# EAGLE design Proyecto_etapa_1_y_2 (EAGLE 7.5.0)
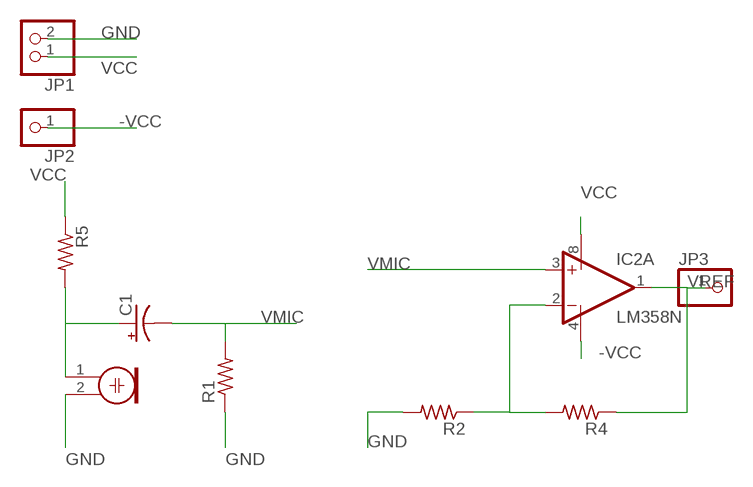
[diagram p0: schematic, sheet 1]

## Parts
C1  CPOL-USE2.5-6  [E2,5-6]
IC2  LM358N  [DIL08]
JP1  PINHD-1X2  [1X02]
JP2  PINHD-1X1  [1X01]
JP3  PINHD-1X1  [1X01]
M2  ELECTRET_MICROPHON-F6050AP  [F6050AP]
R1  R-US_0207/10  [0207/10]
R2  R-US_0207/10  [0207/10]
R4  R-US_0207/10  [0207/10]
R5  R-US_0207/10  [0207/10]

## Nets
-VCC: IC2.4(P:V-) JP2.1
GND: JP1.2 M2.2 R1.1 R2.2
N$1: C1.+ M2.1 R5.2
N$2: IC2.2(A:-IN) R2.1 R4.2
VCC: IC2.8(P:V+) JP1.1 R5.1
VMIC: C1.- IC2.3(A:+IN) R1.2
VREF: IC2.1(A:OUT) JP3.1 R4.1
Unconnected: IC2.5(B:+IN) IC2.6(B:-IN) IC2.7(B:OUT)

## Library data of the parts
C1 = rcl:CPOL-US: POLARIZED CAPACITOR, American symbol
IC2 = linear:LM358: OP AMP also LM158; LM258; LM2904 Source: http://cache.national.com/ds/LM/LM158.pdf
JP1 = pinhead:PINHD-1X2: PIN HEADER
JP2 JP3 = pinhead:PINHD-1X1: PIN HEADER
M2 = microphon:ELECTRET_MICROPHON-: Electret Condenser Microphone
R1 R2 R4 R5 = rcl:R-US_: RESISTOR, American symbol

## Board
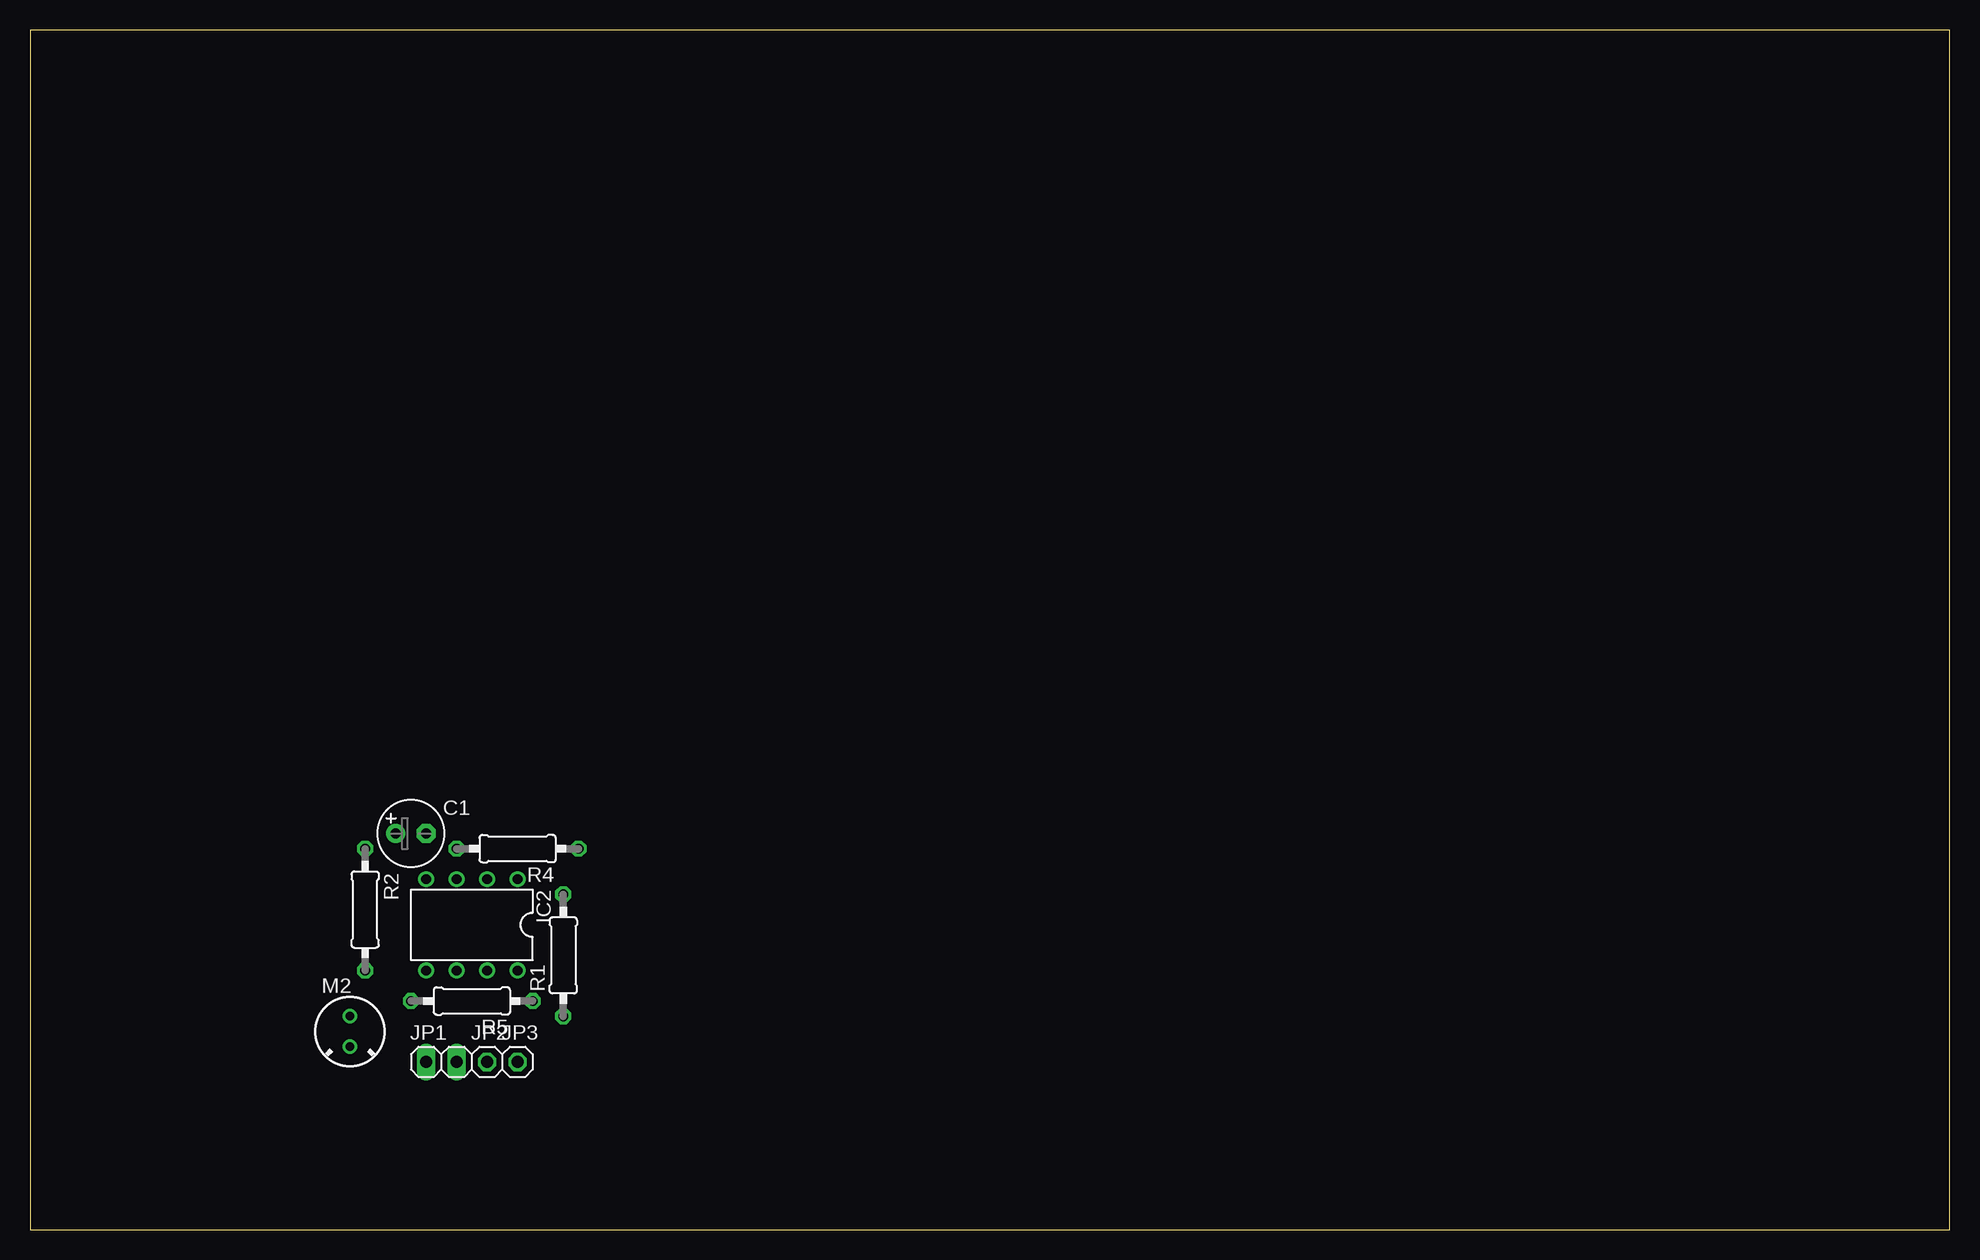
[diagram p1: board, top side]
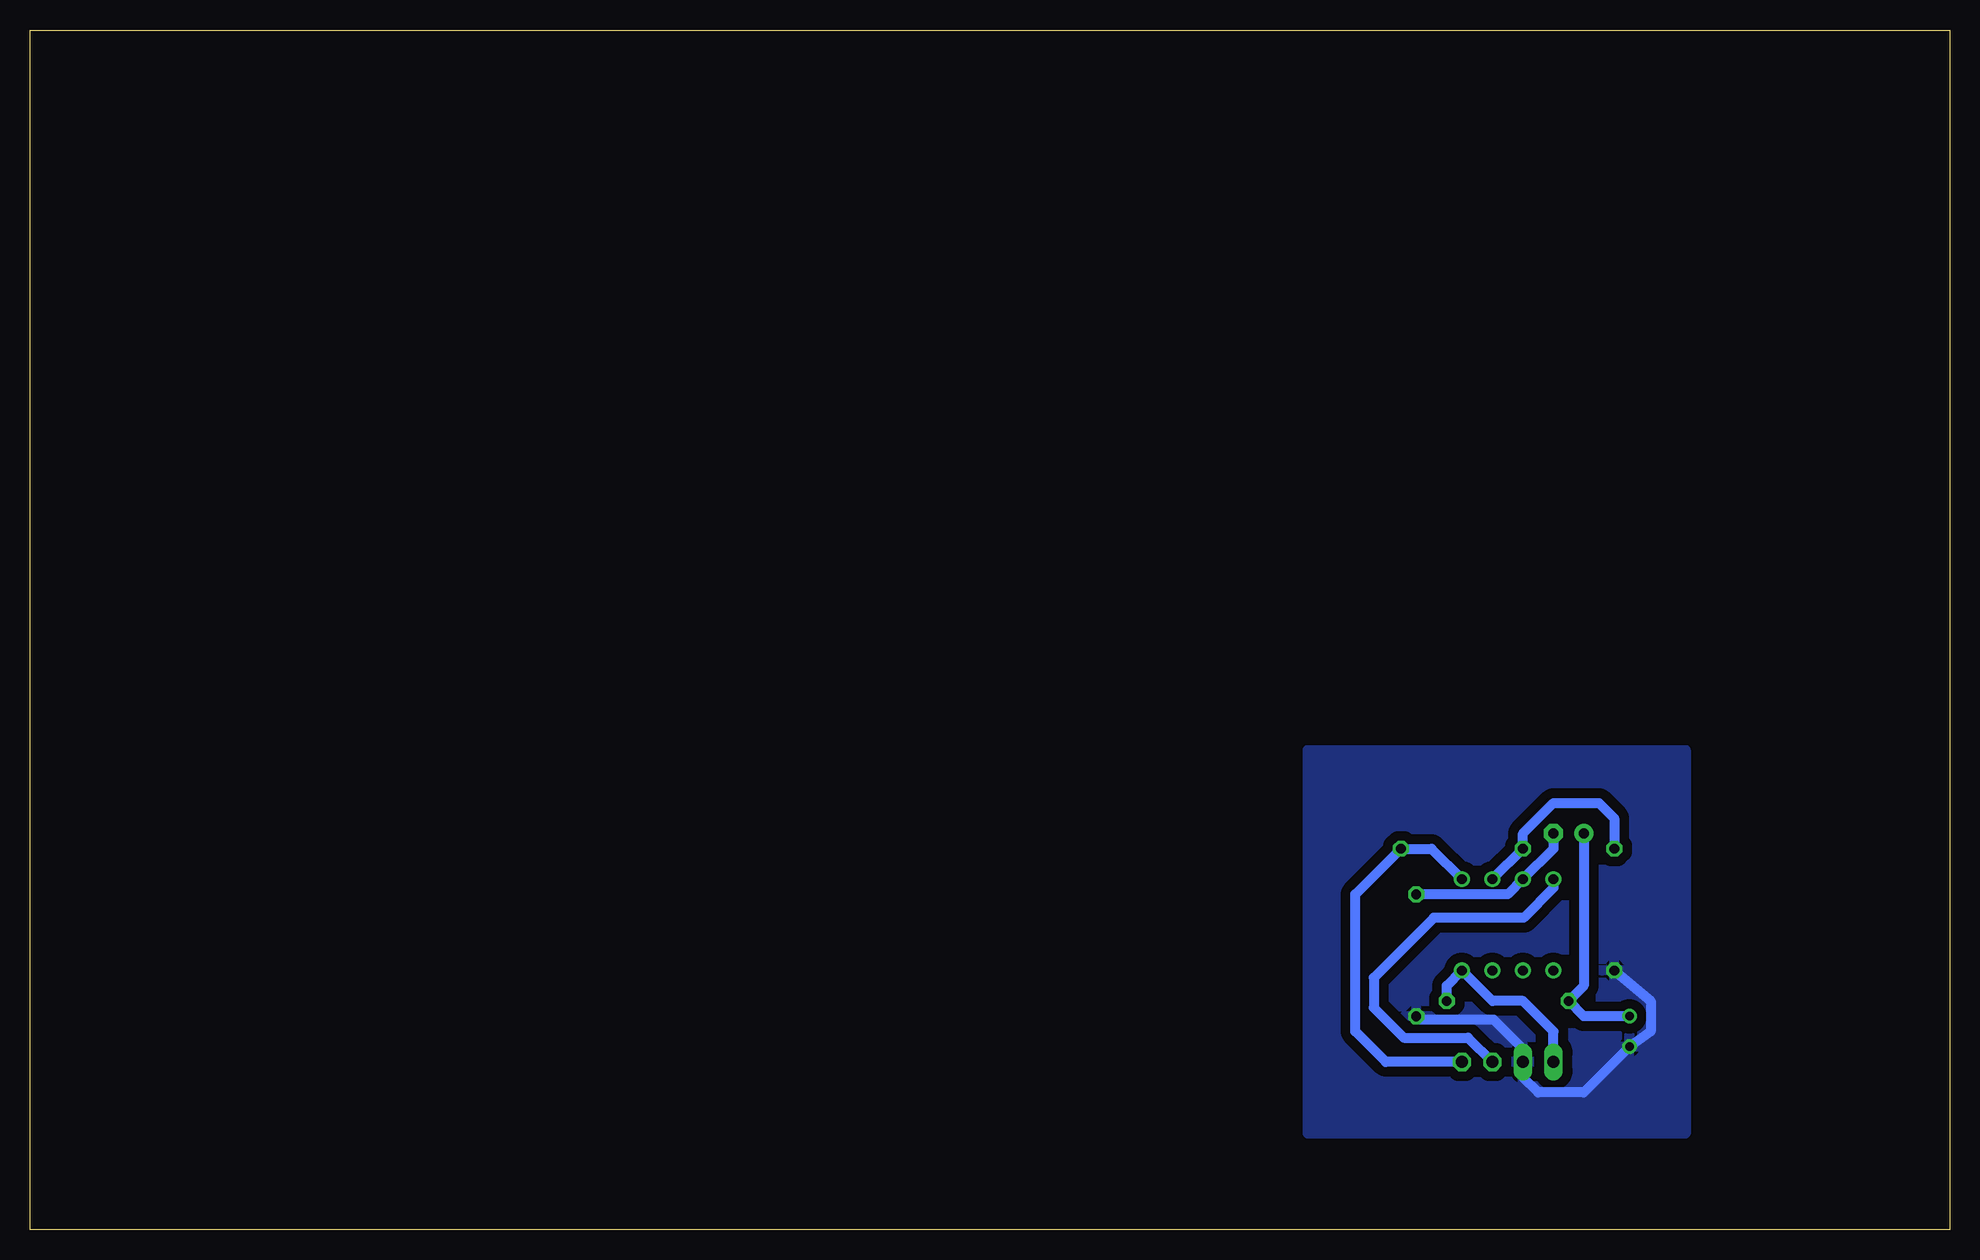
[diagram p2: board, bottom side, seen from below]

Size 160 x 100 mm. Coordinates in mm from the lower left corner, seen from the top.
Outline: 0,0 160,0 160,100 0,100 0,0
Copper layers (1*16): Top 0.035mm / dielectric 1.5mm / Bottom 0.035mm
Design rules "default": minimum track width 10mil, minimum drill 24mil, track to track 8mil, track to pad 8mil, pad to pad 8mil, via to via 8mil, smd to smd 8mil, copper to edge 40mil, drill to drill 8mil, minimum pad ring 10mil, minimum via ring 8mil, stop-mask expansion 4mil, vias tented up to drill 0mil, thermal gap 10mil

### Footprints (pad centres in the part's own frame; a part is rotated, then mirrored left to right if it is on the bottom)
E2,5-6 = drill 0.813 pad 1.6: + -1.27,0 | drill 0.813 pad 1.6 octagon: - 1.27,0
DIL08 = drill 0.813 pad 1.27: 1 -3.81,-3.81; 2 -1.27,-3.81; 3 1.27,-3.81; 4 3.81,-3.81; 5 3.81,3.81; 6 1.27,3.81; 7 -1.27,3.81; 8 -3.81,3.81
1X02 = drill 1.016 long: 1 -1.27,0; 2 1.27,0
1X01 = drill 1.016 octagon: 1 0,0
F6050AP = drill 0.7 pad 1.2: 1 0,1.27; 2 0,-1.27
0207/10 = drill 0.813 octagon: 1 -5.08,0; 2 5.08,0

### Placement (x,y rotation side)
C1  31.75,33.02 0 top
IC2  36.83,25.4 180 top
JP1  34.29,13.97 0 top
JP2  38.1,13.97 0 top
JP3  40.64,13.97 0 top
M2  26.67,16.51 0 top
R1  44.45,22.86 90 top
R2  27.94,26.67 270 top
R4  40.64,31.75 180 top
R5  36.83,19.05 180 top

### Tracks (layer width: path | path; a pad name or v marks a point on that pad's centre or on a via)
-VCC
  Bottom 0.813: IC2.4 33.02,28.48 35.5,26 43,26 48,21 48,18.5 45.5,16 40.13,16 JP2.1
GND
  Bottom 0.813: R2.2 24.9,19.05 24.9,16.51 M2.2 30.48,11.43 34.29,11.43 35.56,12.7 JP1.2 35.56,15.06 38,17.5 44.17,17.5 R1.1
  pour Bottom (isolate 0.813): 22,8 53.5,8 53.5,40 22,40
N$1
  Bottom 0.813: C1.+ 30.48,20.32 R5.2 30.48,17.78 M2.1
N$2
  Bottom 0.813: IC2.2 R4.2 35.56,33.02 33.02,35.56 29.21,35.56 27.94,34.29 R2.1
VCC
  Bottom 0.813: JP1.1 33.02,16.51 35.56,19.05 38.1,19.05 IC2.8 41.91,20.32 R5.1
VMIC
  Bottom 0.813: R1.2 36.83,27.94 IC2.3 33.02,31.75 C1.-
VREF
  Bottom 0.813: IC2.1 43.18,31.75 R4.1 49.53,27.94 49.53,16.51 46.99,13.97 JP3.1